# Altium schematic sheet 07-LogicXOR.SchDoc
size A4
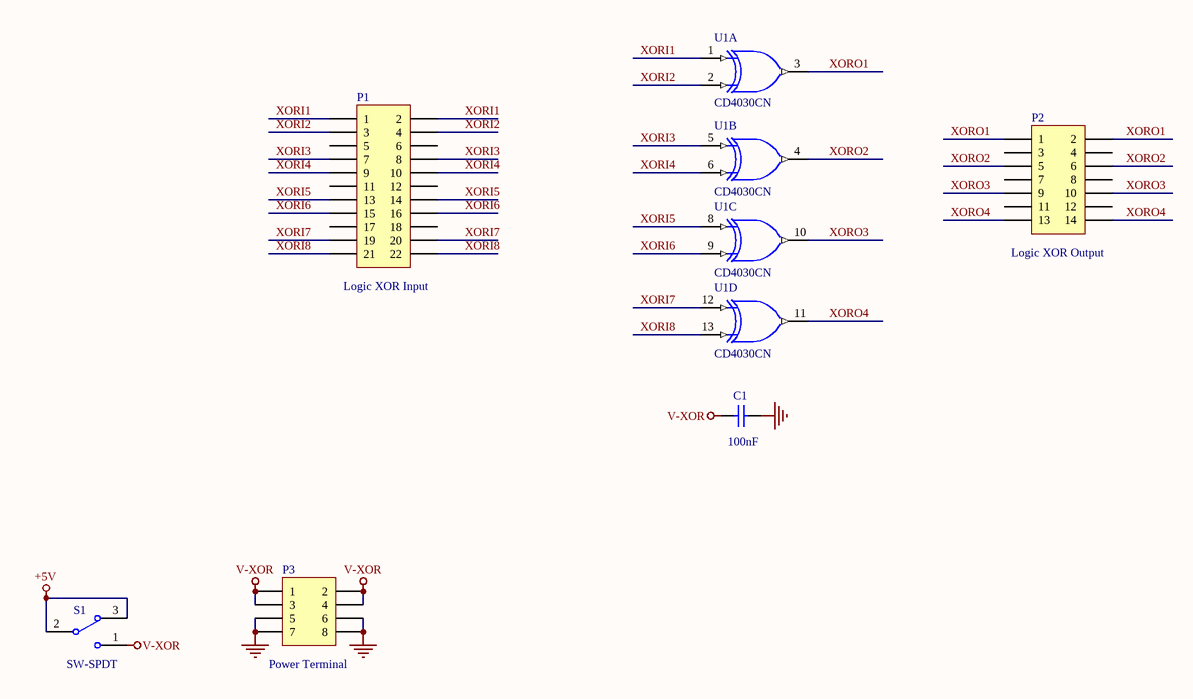
[diagram p0: 07-LogicXOR.SchDoc]

## Parts
C1  value 100nF  [C-0805]  (hidden comment: 104)
P1  value Logic XOR Input  [HDR2X11]  (hidden comment: Header 11X2)
P2  value Logic XOR Output  [HDR2X7]  (hidden comment: H7X2)
P3  Publisher: Power Terminal  [HDR2X4]  (hidden comment: Header 4X2)
S1  SW-SPDT  [SW-DIP1SMD]
U1  CD4030CN  [SK-DIP14-300]  (parts A,B,C,D of 4)

## Nets
+5V: S1.2 S1.3
GND: C1.2 P3.5 P3.6 P3.7 P3.8 U1.7(GND)
V-XOR: C1.1 P3.1 P3.2 P3.3 P3.4 S1.1
VDD: U1.14(V-XOR)
XORI1: P1.1 P1.2 U1.1(B)
XORI2: P1.3 P1.4 U1.2(A)
XORI3: P1.7 P1.8 U1.5(A)
XORI4: P1.9 P1.10 U1.6(B)
XORI5: P1.13 P1.14 U1.8(A)
XORI6: P1.15 P1.16 U1.9(B)
XORI7: P1.19 P1.20 U1.12(A)
XORI8: P1.21 P1.22 U1.13(B)
XORO1: P2.1 P2.2 U1.3(J)
XORO2: P2.5 P2.6 U1.4(J)
XORO3: P2.9 P2.10 U1.10(J)
XORO4: P2.13 P2.14 U1.11(J)

Not connected (* = marked no-connect by the designer): P1 5 6 11 12 17 18; P2 3 4 7 8 11 12

## Library data of the parts
C1 = Cap: Capacitor; Published: 8-Jun-2000; LatestRevisionDate: 17-Jul-2002; LatestRevisionNote: Re-released for DXP Platform.; PackageReference: RAD-0.3; Publisher: Altium Limited; PackageDescription: Radial Cap, Thru-Hole; 2 Leads; 0.3 in Pin Spacing
P1 = Header 11X2: Header, 11-Pin, Dual row; LatestRevisionDate: 17-Jul-2002; LatestRevisionNote: Re-released for DXP Platform.
P2 = Header 7X2: Header, 7-Pin, Dual row; LatestRevisionDate: 17-Jul-2002; LatestRevisionNote: Re-released for DXP Platform.
P3 = Header 4X2: Header, 4-Pin, Dual row; LatestRevisionDate: 17-Jul-2002; LatestRevisionNote: Re-released for DXP Platform.
S1 = SW-SPDT: SPDT Subminiature Toggle Switch, Right Angle Mounting, Vertical Actuation; Published: 24-Mar-1999; LatestRevisionDate: 17-Dec-2003; LatestRevisionNote: Schematic revised, PCB Footprint replaced.; DatasheetVersion: 05-Dec-2000; PackageReference: TL36WW15050; Publisher: Altium Limited; PackageDescription: Switch; 4 Leads; ComponentLink1Description: Manufacturer Link; ComponentLink1URL: http://www.apem.com
U1 = CD4030CN: Quad Exclusive OR Gate, 14-Pin PDIP; IC_Technology: C; Published: 17-Jul-2002; LatestRevisionDate: 29-May-2009; LatestRevisionNote: Component Body Added.; DatasheetVersion: Jan-1999; PackageVersion: 2000; PackageReference: N14A; Publisher: Altium Limited; PackageDescription: DIP, 14-Pin, Row Spacing 7.62 mm, Pitch 2.54 mm; ComponentLink1Description: Manufacturer Link; ComponentLink1URL: http://www.fairchildsemi.com/